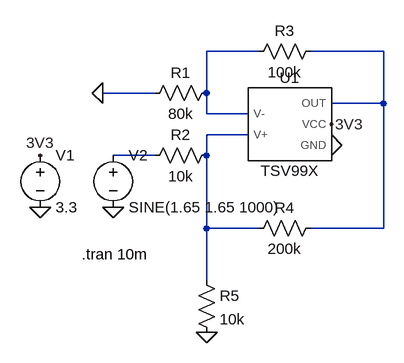
[diagram p0: schematic Constant current source TSV99x.asc]
Constant current source TSV99x.asc, the LTspice schematic file:
Version 4
SHEET 1 880 680
WIRE 304 32 224 32
WIRE 496 32 384 32
WIRE 144 96 64 96
WIRE 224 96 224 32
WIRE 496 112 496 32
WIRE 496 112 416 112
WIRE 224 128 224 96
WIRE 288 128 224 128
WIRE 288 160 224 160
WIRE 144 192 80 192
WIRE 224 192 224 160
WIRE 224 304 224 192
WIRE 304 304 224 304
WIRE 496 304 496 112
WIRE 496 304 384 304
WIRE 224 384 224 304
FLAG -32 272 0
FLAG -32 192 3V3
FLAG 416 144 3V3
FLAG 416 176 0
FLAG 64 96 0
FLAG 224 464 0
FLAG 80 272 0
DATAFLAG 368 416 "I(R5)"
SYMBOL AutoGenerated\\TSV99X 352 144 R0
SYMATTR InstName U1
SYMBOL voltage -32 176 R0
SYMATTR InstName V1
SYMATTR Value 3.3
SYMBOL res 128 112 R270
WINDOW 0 32 56 VTop 2
WINDOW 3 0 56 VBottom 2
SYMATTR InstName R1
SYMATTR Value 80k
SYMBOL res 128 208 R270
WINDOW 0 32 56 VTop 2
WINDOW 3 0 56 VBottom 2
SYMATTR InstName R2
SYMATTR Value 10k
SYMBOL res 288 48 R270
WINDOW 0 32 56 VTop 2
WINDOW 3 0 56 VBottom 2
SYMATTR InstName R3
SYMATTR Value 100k
SYMBOL res 288 320 R270
WINDOW 0 32 56 VTop 2
WINDOW 3 0 56 VBottom 2
SYMATTR InstName R4
SYMATTR Value 200k
SYMBOL res 208 368 R0
SYMATTR InstName R5
SYMATTR Value 10k
SYMBOL voltage 80 176 R0
WINDOW 123 0 0 Left 2
WINDOW 39 0 0 Left 2
SYMATTR InstName V2
SYMATTR Value SINE(1.65 1.65 1000)
TEXT 32 344 Left 2 !.tran 10m

The netlist it stands for:
* Constant current source TSV99x.asc
XU1 N001 N003 N002 3V3 0 TSV99X  ; pins V- V+ OUT VCC GND
V1 3V3 0 3.3
R1 0 N001 80k
R2 N004 N003 10k
R3 N001 N002 100k
R4 N003 N002 200k
R5 N003 0 10k
V2 N004 0 SINE(1.65 1.65 1000)
.tran 10m
.lib D:\Github\LTSpice\LTS0000 - Models\TSX631.mod
.backanno
.end